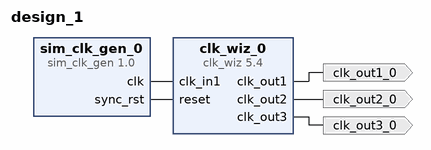
[diagram p0: block diagram of the top level]
# Vivado block design design_1, xc7k70tfbg484-2L, Vivado 2017.4
create_bd_design design_1

create_bd_port -dir O -type clk clk_out1_0
set_property -dict {CONFIG.FREQ_HZ 576000000} [get_bd_ports clk_out1_0]
create_bd_port -dir O -type clk clk_out2_0
set_property -dict {CONFIG.FREQ_HZ 192000000} [get_bd_ports clk_out2_0]
create_bd_port -dir O -type clk clk_out3_0
set_property -dict {CONFIG.FREQ_HZ 52363636} [get_bd_ports clk_out3_0]

create_bd_cell -type ip -vlnv xilinx.com:ip:clk_wiz:5.4 clk_wiz_0
set_property -dict [list \
  CONFIG.ENABLE_CLOCK_MONITOR false \
  CONFIG.PRIMITIVE MMCM \
  CONFIG.USE_SPREAD_SPECTRUM false \
  CONFIG.PRIM_IN_FREQ 36 \
  CONFIG.CLKIN1_JITTER_PS 277.77000000000004 \
  CONFIG.CLKOUT1_USED true \
  CONFIG.CLKOUT2_USED true \
  CONFIG.CLKOUT3_USED true \
  CONFIG.CLKOUT4_USED false \
  CONFIG.NUM_OUT_CLKS 3 \
  CONFIG.CLKOUT1_REQUESTED_OUT_FREQ 576.000 \
  CONFIG.CLKOUT1_REQUESTED_DUTY_CYCLE 50.0 \
  CONFIG.CLKOUT2_REQUESTED_OUT_FREQ 192.000 \
  CONFIG.CLKOUT2_REQUESTED_DUTY_CYCLE 50.0 \
  CONFIG.CLKOUT3_REQUESTED_OUT_FREQ 52.000 \
  CONFIG.CLKOUT3_REQUESTED_DUTY_CYCLE 50.0 \
  CONFIG.CLKOUT4_REQUESTED_DUTY_CYCLE 50.000 \
  CONFIG.MMCM_DIVCLK_DIVIDE 1 \
  CONFIG.MMCM_BANDWIDTH OPTIMIZED \
  CONFIG.MMCM_CLKFBOUT_MULT_F 32.000 \
  CONFIG.MMCM_CLKIN1_PERIOD 27.778 \
  CONFIG.MMCM_CLKIN2_PERIOD 10.0 \
  CONFIG.MMCM_CLKOUT0_DIVIDE_F 2.000 \
  CONFIG.MMCM_CLKOUT1_DIVIDE 6 \
  CONFIG.MMCM_CLKOUT2_DIVIDE 22 \
  CONFIG.CLKOUT1_JITTER 129.300 \
  CONFIG.CLKOUT1_PHASE_ERROR 173.591 \
  CONFIG.CLKOUT2_JITTER 151.084 \
  CONFIG.CLKOUT2_PHASE_ERROR 173.591 \
  CONFIG.CLKOUT3_JITTER 193.692 \
  CONFIG.CLKOUT3_PHASE_ERROR 173.591 \
  CONFIG.CLKOUT4_JITTER 106.373 \
  CONFIG.CLKOUT4_PHASE_ERROR 491.314 \
] [get_bd_cells clk_wiz_0]
create_bd_cell -type ip -vlnv xilinx.com:ip:sim_clk_gen:1.0 sim_clk_gen_0
set_property -dict {CONFIG.RESET_POLARITY ACTIVE_HIGH CONFIG.FREQ_HZ 36000000} [get_bd_cells sim_clk_gen_0]

# ---- connections ----

connect_bd_net [get_bd_pins clk_wiz_0/clk_out1] [get_bd_ports clk_out1_0]
connect_bd_net [get_bd_pins clk_wiz_0/clk_out2] [get_bd_ports clk_out2_0]
connect_bd_net [get_bd_pins clk_wiz_0/clk_out3] [get_bd_ports clk_out3_0]
connect_bd_net [get_bd_pins sim_clk_gen_0/clk] [get_bd_pins clk_wiz_0/clk_in1]
connect_bd_net [get_bd_pins sim_clk_gen_0/sync_rst] [get_bd_pins clk_wiz_0/reset]

validate_bd_design
save_bd_design
